# EAGLE design RaspNRF24 (EAGLE 7.4.0)
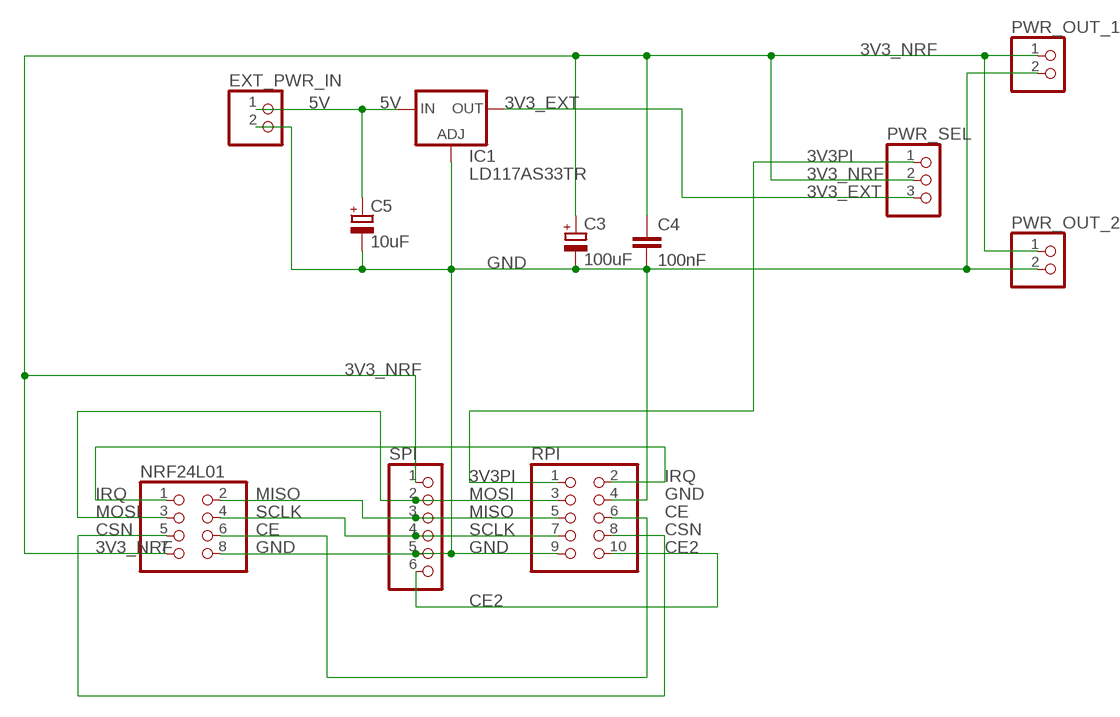
[diagram p0: schematic, sheet 1]

## Parts
C3  100uF  CPOL-EUE2.5-5  [E2,5-5]
C4  100nF  C-EU025-024X044  [C025-024X044]
C5  10uF  CPOL-EUE2-4  [E2-4]
EXT_PWR_IN  PINHD-1X2  [1X02]
IC1  LD117AS33TR  [SOT223]
NRF24L01  PINHD-2X4  [2X04]
PWR_OUT_1  PINHD-1X2  [1X02]
PWR_OUT_2  PINHD-1X2  [1X02]
PWR_SEL  PINHD-1X3  [1X03]
RPI  PINHD-2X5  [2X05]
SPI  PINHD-1X6  [1X06]

## Nets
3V3_EXT [power]: IC1.4(OUT) PWR_SEL.3
3V3_NRF [power]: C3.+ C4.1 NRF24L01.7 PWR_OUT_1.1 PWR_OUT_2.1 PWR_SEL.2 SPI.1
3V3PI [power]: PWR_SEL.1 RPI.1
5V [power]: C5.+ EXT_PWR_IN.1 IC1.3(IN)
CE: NRF24L01.6 RPI.6
CE2: RPI.10 SPI.6
CSN: NRF24L01.5 RPI.8
GND [power]: C3.- C4.2 C5.- EXT_PWR_IN.2 IC1.1(ADJ) NRF24L01.8 PWR_OUT_1.2 PWR_OUT_2.2 RPI.4 RPI.9 SPI.5
IRQ: NRF24L01.1 RPI.2
MISO: NRF24L01.2 RPI.5 SPI.3
MOSI: NRF24L01.3 RPI.3 SPI.2
SCLK: NRF24L01.4 RPI.7 SPI.4

## Library data of the parts
C3 C5 = rcl:CPOL-EU: POLARIZED CAPACITOR, European symbol
C4 = rcl:C-EU: CAPACITOR, European symbol
EXT_PWR_IN PWR_OUT_1 = pinhead:PINHD-1X2: PIN HEADER
IC1 = v-reg:LD117A?*: Low drop fixed and adjustable positive voltage regulators 1 A Source: http://www.st.com/stonline/products/literature/ds/7194/ld1117axx.pdf
NRF24L01 = pinhead:PINHD-2X4: PIN HEADER
PWR_OUT_2 = pinheadHB:PINHD-1X2: PIN HEADER
PWR_SEL = pinheadHB:PINHD-1X3: PIN HEADER
RPI = pinhead:PINHD-2X5: PIN HEADER
SPI = pinheadHB:PINHD-1X6: PIN HEADER

## Net classes
0 default: width 0.203 mm
1 power: width 0.406 mm, clearance 0.203 mm

## Board
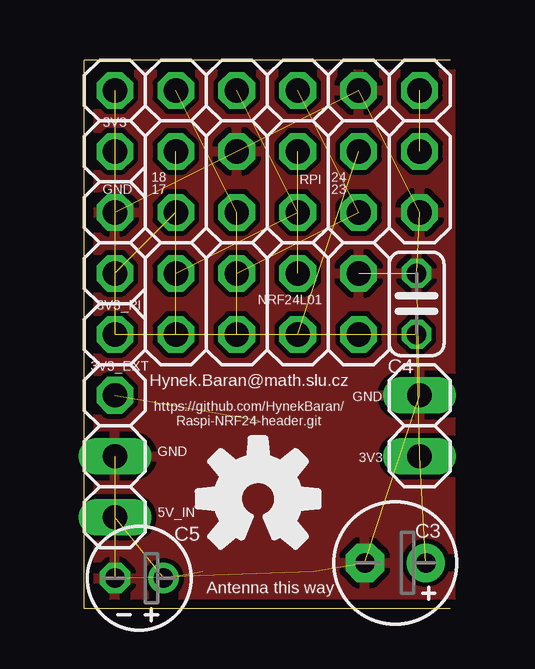
[diagram p1: board, top side]
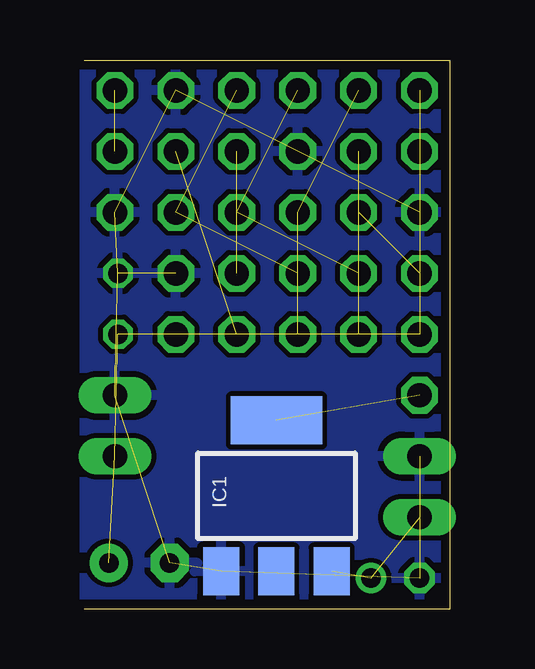
[diagram p2: board, bottom side, seen from below]

Size 15.24 x 22.86 mm. Coordinates in mm from the lower left corner, seen from the top.
Outline: 15.24,0 0,0 0,22.86 15.24,22.86
Copper layers (1*16): Top 0.0356mm / dielectric 1.5011mm / Bottom 0.0356mm
Design rules "LaenPCBOrder": minimum track width 6mil, minimum drill 13mil, track to track 6mil, track to pad 6mil, pad to pad 6mil, via to via 6mil, smd to smd 6mil, copper to edge 15mil, drill to drill 6mil, minimum pad ring 7mil, minimum via ring 7mil, stop-mask expansion 3mil, vias tented up to drill 0mil, thermal gap 10mil

### Footprints (pad centres in the part's own frame; a part is rotated, then mirrored left to right if it is on the bottom)
E2,5-5 = drill 0.813 pad 1.6: + -1.27,0 | drill 0.813 pad 1.6 octagon: - 1.27,0
C025-024X044 = drill 0.813 octagon: 1 -1.27,0; 2 1.27,0
E2-4 = drill 0.813 pad 1.27: + -1.016,0 | drill 0.813 pad 1.27 octagon: - 1.016,0
1X02 = drill 1.016 long: 1 -1.27,0; 2 1.27,0
SOT223 = smd 1.5 x 2: 1 -2.3,-3.15; 2 0,-3.15; 3 2.3,-3.15 | smd 3.8 x 2: 4 0,3.15
2X04 = drill 1.016 octagon: 1 -3.81,-1.27; 2 -3.81,1.27; 3 -1.27,-1.27; 4 -1.27,1.27; 5 1.27,-1.27; 6 1.27,1.27; 7 3.81,-1.27; 8 3.81,1.27
1X02' = drill 1.016 octagon: 1 -1.27,0; 2 1.27,0
1X03 = drill 1.016 octagon: 1 -2.54,0; 2 0,0; 3 2.54,0
2X05 = drill 1.016 octagon: 1 -5.08,-1.27; 2 -5.08,1.27; 3 -2.54,-1.27; 4 -2.54,1.27; 5 0,-1.27; 6 0,1.27; 7 2.54,-1.27; 8 2.54,1.27; 9 5.08,-1.27; 10 5.08,1.27
1X06 = drill 1.016 octagon: 1 -6.35,0; 2 -3.81,0; 3 -1.27,0; 4 1.27,0; 5 3.81,0; 6 6.35,0

### Placement (x,y rotation side)
C3  12.95,1.91 180 top
C4  13.84,12.7 90 top
C5  2.29,1.27 180 top
EXT_PWR_IN  1.27,5.08 90 top
IC1  7.24,4.7 0 bottom
NRF24L01  7.62,12.7 0 top
PWR_OUT_1  13.97,7.62 90 top
PWR_OUT_2  [1X02']  1.27,17.78 270 top
PWR_SEL  1.27,11.43 270 top
RPI  8.89,17.78 0 top
SPI  7.62,21.59 0 top
U$1  [OSHWLOGO_TOL_0.2]  7.24,4.57 0 top

### Tracks (layer width: path | path; a pad name or v marks a point on that pad's centre or on a via)
3V3_EXT  (1 unrouted)
3V3_NRF  (6 unrouted)
3V3PI  (1 unrouted)
5V  (2 unrouted)
CE  (1 unrouted)
CE2  (1 unrouted)
CSN  (1 unrouted)
GND  (10 unrouted)
  pour Bottom: 0,22.86 15.24,22.86 15.24,0 0,0
  pour Top: 0,22.86 15.24,22.86 15.24,0 0,0
IRQ  (1 unrouted)
MISO  (2 unrouted)
MOSI  (2 unrouted)
SCLK  (2 unrouted)

### Text on the board
tPlace: 3V3 | 18 | 24 | GND | 17 | 23 | 3V3_PI | 3V3_EXT | Hynek.Baran@math.slu.cz | GND | https://github.com/HynekBaran/ / Raspi-NRF24-header.git | GND | 3V3 | 5V_IN | Antenna this way